# Altium schematic sheet top.SchDoc: Top
size Letter; Revision: 1; SheetNumber: 1; SheetTotal: 2
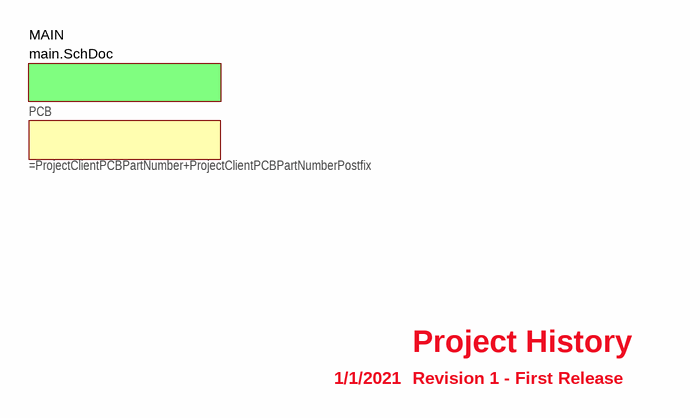
[diagram p0: top.SchDoc]

## Parts
PCB  (no value)  (mechanical)

## Sub-sheets
MAIN = main.SchDoc: no entries

## Notes on the sheet
- 1/1/2021
- Revision 1 - First Release
- Project History
- Designed By:
- Designed For:
- Title
- Project
- Engineer:
- Drawn By:
- Reviewed By:
- Client Document Part Number:
- Client PCB Part Number:
- Client PCBA Part Number:

## Library data of the parts
PCB = PCB: Printed Circuit Board; Manufacturer: =ProjectClient; Manufacturer P/N: =ProjectClientPCBPartNumber+ProjectClientPCBPartNumberPostfix